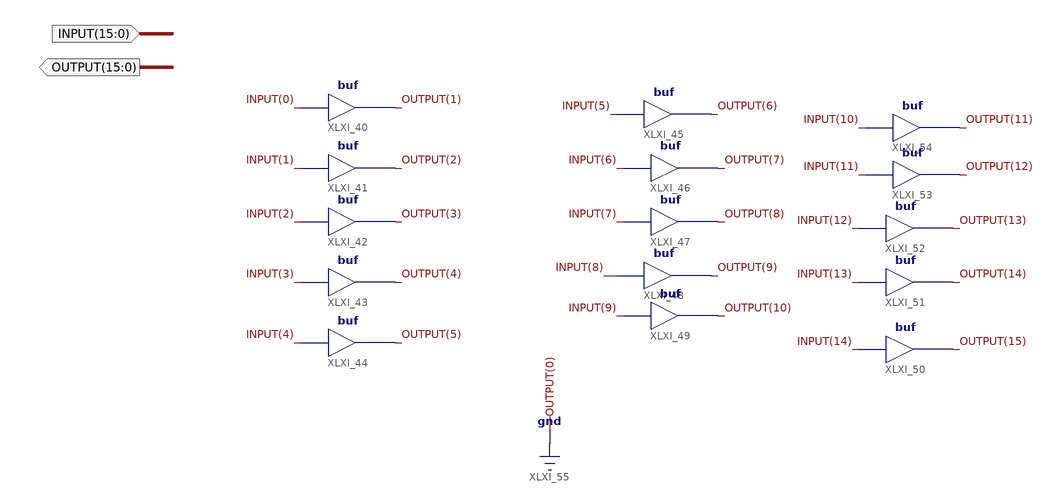
[diagram p0: schematic sheet 1]
// Xilinx ISE schematic SL1.sch (spartan3e) as structural Verilog: 15 symbols, 2 ports
module SL1 (
  input  [15:0] INPUT,
  output [15:0] OUTPUT
);

  buf XLXI_45 (OUTPUT[6], INPUT[5]);
  buf XLXI_46 (OUTPUT[7], INPUT[6]);
  buf XLXI_47 (OUTPUT[8], INPUT[7]);
  buf XLXI_48 (OUTPUT[9], INPUT[8]);
  buf XLXI_40 (OUTPUT[1], INPUT[0]);
  buf XLXI_41 (OUTPUT[2], INPUT[1]);
  buf XLXI_42 (OUTPUT[3], INPUT[2]);
  buf XLXI_43 (OUTPUT[4], INPUT[3]);
  buf XLXI_44 (OUTPUT[5], INPUT[4]);
  buf XLXI_50 (OUTPUT[15], INPUT[14]);
  buf XLXI_51 (OUTPUT[14], INPUT[13]);
  buf XLXI_52 (OUTPUT[13], INPUT[12]);
  buf XLXI_53 (OUTPUT[12], INPUT[11]);
  buf XLXI_54 (OUTPUT[11], INPUT[10]);
  buf XLXI_49 (OUTPUT[10], INPUT[9]);

  assign OUTPUT[0] = 1'b0;
endmodule
